# Altium schematic sheet DisplayPort.SchDoc
size A3; SheetNumber: 6; SheetTotal: 11
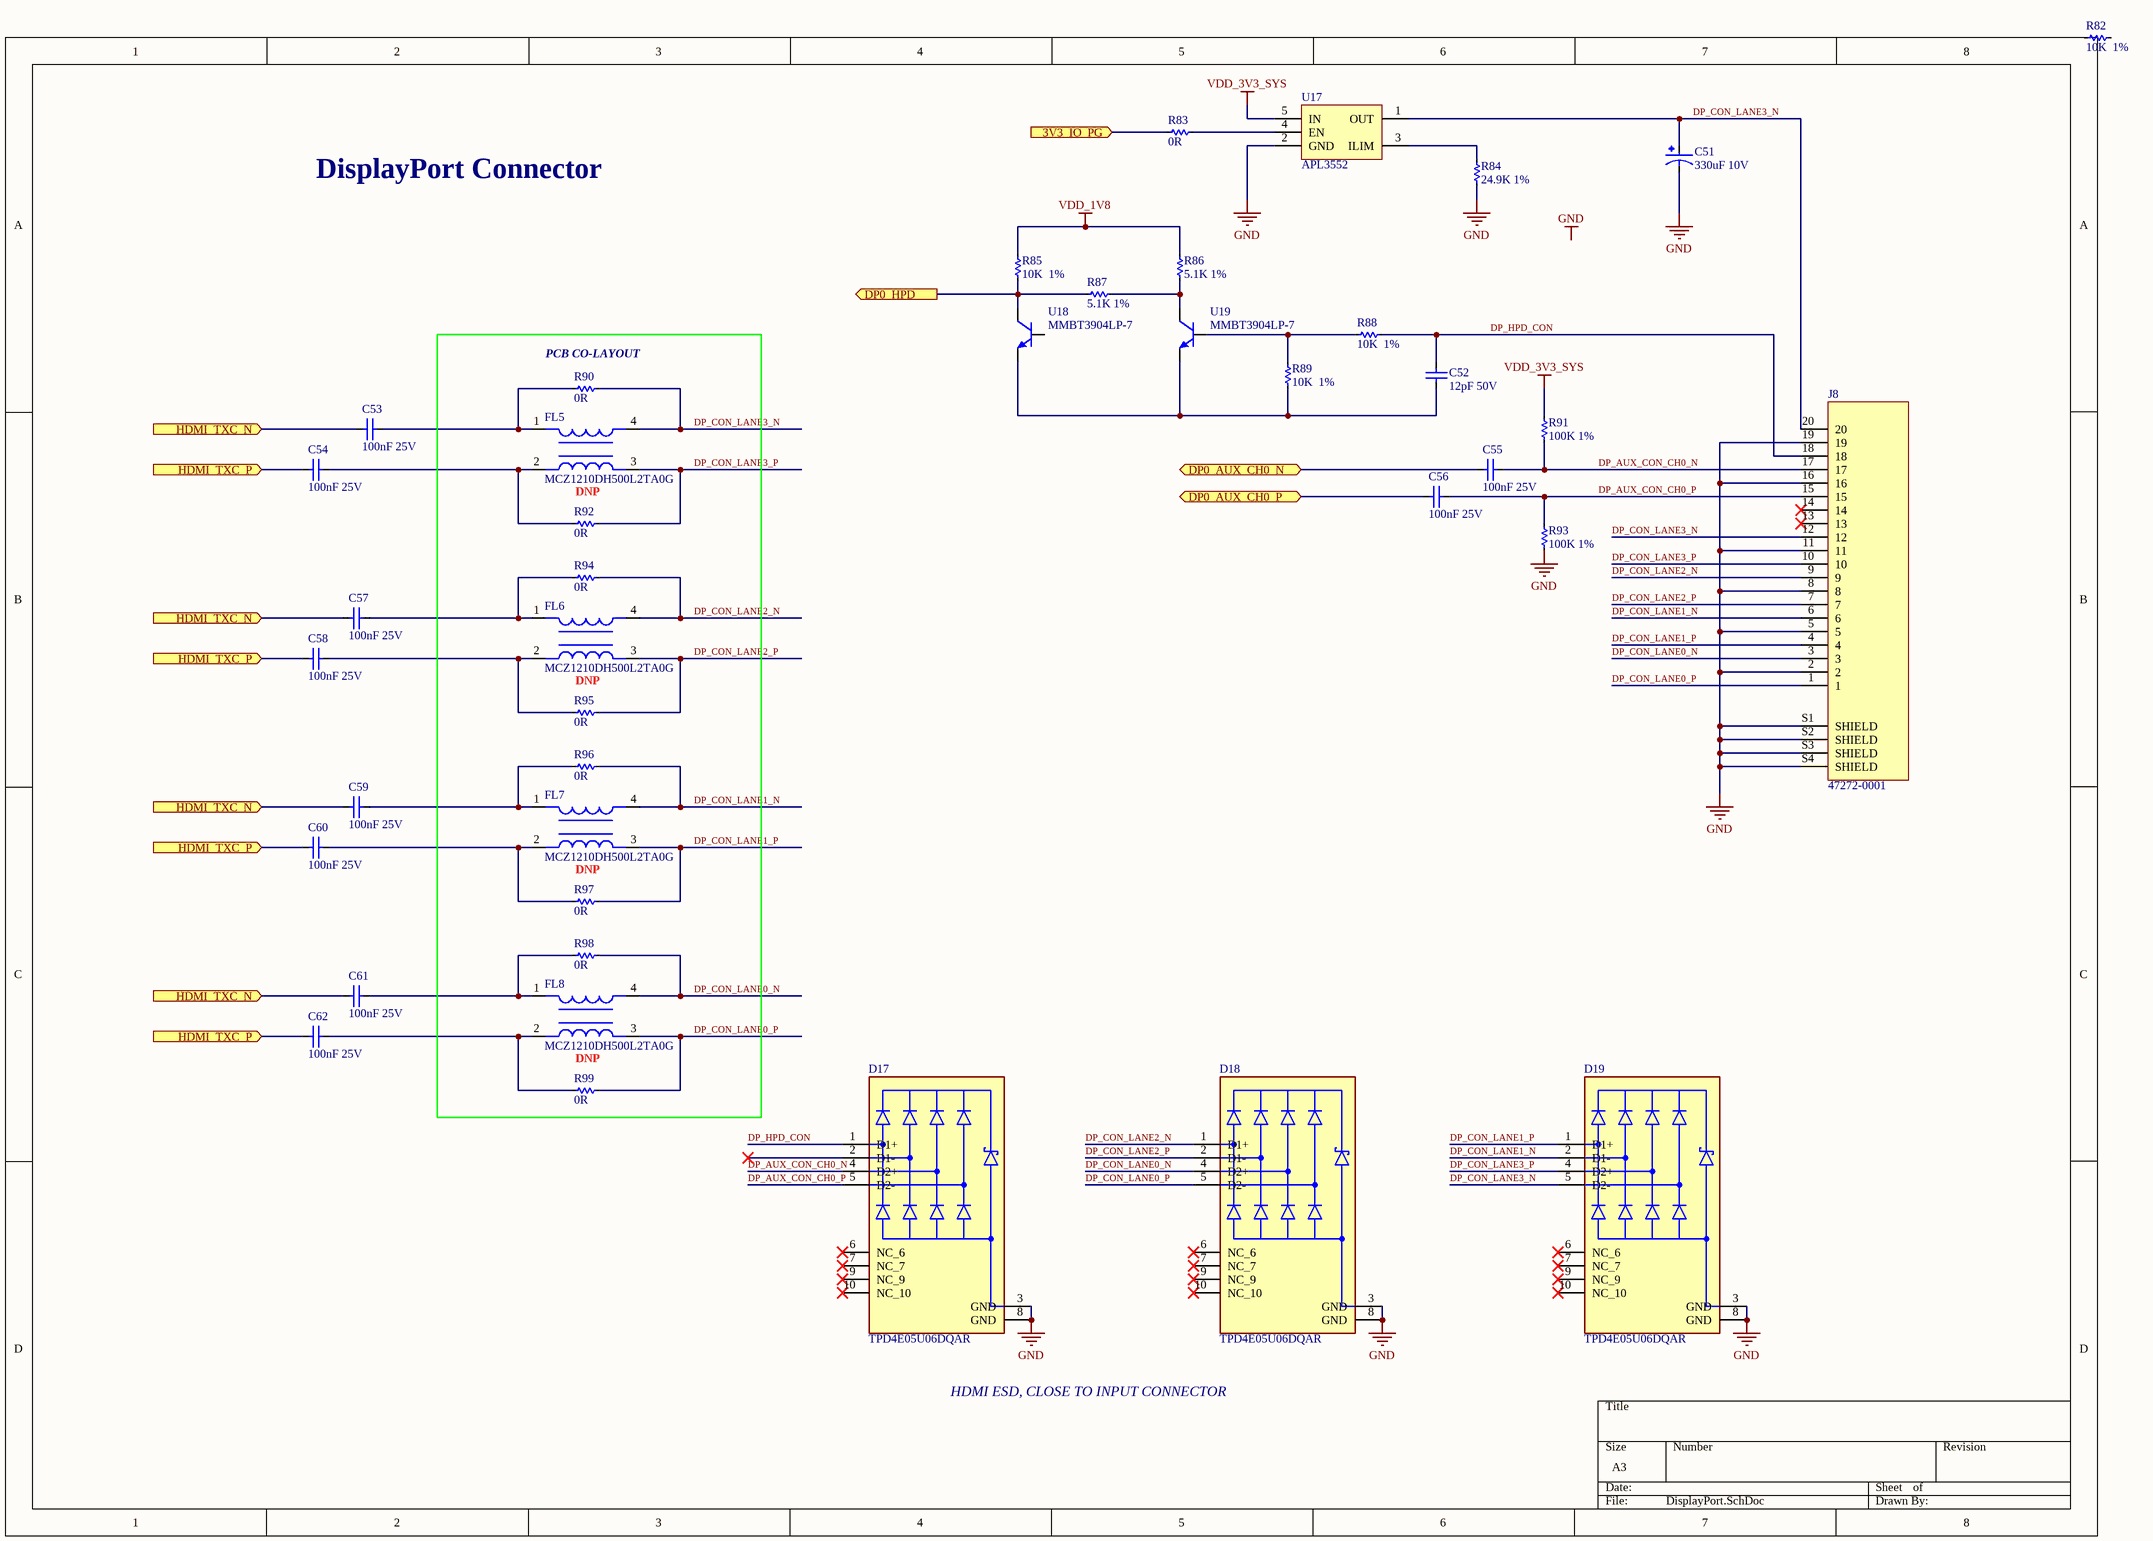
[diagram p0: DisplayPort.SchDoc]

## Parts
C51  330uF 10V  [C2917_Tantalum]
C52  12pF 50V  [C0402]
C53  100nF 25V  [C0402]
C54  100nF 25V  [C0402]
C55  100nF 25V  [C0402]
C56  100nF 25V  [C0402]
C57  100nF 25V  [C0402]
C58  100nF 25V  [C0402]
C59  100nF 25V  [C0402]
C60  100nF 25V  [C0402]
C61  100nF 25V  [C0402]
C62  100nF 25V  [C0402]
D17  TPD4E05U06DQAR  [TPD4E05U06DQAR]
D18  TPD4E05U06DQAR  [TPD4E05U06DQAR]
D19  TPD4E05U06DQAR  [TPD4E05U06DQAR]
FL5  MCZ1210DH500L2TA0G  [MCZ1210DH500L2TA0G]
FL6  MCZ1210DH500L2TA0G  [MCZ1210DH500L2TA0G]
FL7  MCZ1210DH500L2TA0G  [MCZ1210DH500L2TA0G]
FL8  MCZ1210DH500L2TA0G  [MCZ1210DH500L2TA0G]
J8  47272-0001  [47272-0001]
R82  10K  1%  [R0402]
R83  0R  [R0402]
R84  24.9K 1%  [R0402]
R85  10K  1%  [R0402]
R86  5.1K 1%  [R0402]
R87  5.1K 1%  [R0402]
R88  10K  1%  [R0402]
R89  10K  1%  [R0402]
R90  0R  [R0402]
R91  100K 1%  [R0402]
R92  0R  [R0402]
R93  100K 1%  [R0402]
R94  0R  [R0402]
R95  0R  [R0402]
R96  0R  [R0402]
R97  0R  [R0402]
R98  0R  [R0402]
R99  0R  [R0402]
U17  APL3552  [SOT23-5]
U18  MMBT3904LP-7  [DFN1006-3]
U19  MMBT3904LP-7  [DFN1006-3]

## Ports
3V3_IO_PG (in), DP0_AUX_CH0_N (bidir), DP0_AUX_CH0_P (bidir), DP0_HPD (out), HDMI_TXC_N (in), HDMI_TXC_P (in)

## Nets
GND: C51.2(C) D17.3(GND) D17.8(GND) D18.3(GND) D18.8(GND) D19.3(GND) D19.8(GND) J8.2 J8.5 J8.8 J8.11 J8.16 J8.19 J8.S1(SHIELD) J8.S2(SHIELD) J8.S3(SHIELD) J8.S4(SHIELD) R84.1 R93.1 U17.2(GND)
VDD_1V8: R85.2 R86.2
VDD_3V3_SYS: R91.2 U17.5(IN)
3V3_IO_PG: R83.1 ; port 3V3_IO_PG
DP0_AUX_CH0_N: C55.1 ; port DP0_AUX_CH0_N
DP0_AUX_CH0_P: C56.1 ; port DP0_AUX_CH0_P
DP0_HPD: R85.1 R87.1 U18.3(C) ; port DP0_HPD
DP_AUX_CON_CH0_N: C55.2 D17.4(D2+) J8.17 R91.1
DP_AUX_CON_CH0_P: C56.2 D17.5(D2-) J8.15 R93.2
DP_CON_LANE0_N: D18.4(D2+) FL8.4 J8.3 R98.2
DP_CON_LANE0_P: D18.5(D2-) FL8.3 J8.1 R99.2
DP_CON_LANE1_N: D19.2(D1-) FL7.4 J8.6 R96.2
DP_CON_LANE1_P: D19.1(D1+) FL7.3 J8.4 R97.2
DP_CON_LANE2_N: D18.1(D1+) FL6.4 J8.9 R94.2
DP_CON_LANE2_P: D18.2(D1-) FL6.3 J8.7 R95.2
DP_CON_LANE3_N: C51.1(A) D19.5(D2-) FL5.4 J8.12 J8.20 R90.2 U17.1(OUT)
DP_CON_LANE3_P: D19.4(D2+) FL5.3 J8.10 R92.2
DP_HPD_CON: C52.2 D17.1(D1+) J8.18 R88.2
HDMI_TXC_N: C53.1 C57.1 C59.1 C61.1 ; port HDMI_TXC_N
HDMI_TXC_P: C54.1 C58.1 C60.1 C62.1 ; port HDMI_TXC_P
NetC52_1: C52.1 R89.1 U18.2(E) U19.2(E)
NetC53_2: C53.2 FL5.1 R90.1
NetC54_2: C54.2 FL5.2 R92.1
NetC57_2: C57.2 FL6.1 R94.1
NetC58_2: C58.2 FL6.2 R95.1
NetC59_2: C59.2 FL7.1 R96.1
NetC60_2: C60.2 FL7.2 R97.1
NetC61_2: C61.2 FL8.1 R98.1
NetC62_2: C62.2 FL8.2 R99.1
NetR83_2: R83.2 U17.4(EN)
NetR84_2: R84.2 U17.3(ILIM)
NetR86_1: R86.1 R87.2 U19.3(C)
NetR88_1: R88.1 R89.2 U19.1(B)

Not connected (* = marked no-connect by the designer): D17 2(D1-)* 6(NC_6)* 7(NC_7)* 9(NC_9)* 10(NC_10)*; D18 6(NC_6)* 7(NC_7)* 9(NC_9)* 10(NC_10)*; D19 6(NC_6)* 7(NC_7)* 9(NC_9)* 10(NC_10)*; J8 13* 14*; R82 1 2; U18 1(B)

## Notes on the sheet
- DisplayPort Connector
- (near R90) PCB CO-LAYOUT
- DNP
- HDMI ESD, CLOSE TO INPUT CONNECTOR
- Labels drawn without touching a wire or pin: GND

## Library data of the parts
C51 = T55D337M010C0025: Cap Tant Polymer 330uF 10VDC D CASE 20% (7.3 X 4.3 X 2.8mm) SMD 7343-31 0.025 Ohm 105C T/R; Manufacturer: Vishay Sprague; Supplier 1: Mouser; Manufacturer Part Number: T55D337M010C0025; RoHS: Yes; Category: Tantalum Capacitors; Stock 1: 112760; Pricing 1: 1=1.79000, 10=1.23000, 50=1.23000, 100=1.07000, 1000=0.68200, 10000=0.52700 (USD); Lead Free: Lead Free; RoHS Compliant: Yes; Supplier Part Number 1: 74-T55D337M010C0025
C52 = CC0402JRNPO9BN120: 0402 12 pF 50 V ±5 % Tolerance NP0 SMT Multilayer Ceramic Capacitor; Manufacturer: Yageo; Tolerance: 5%; Dielectric: C0G; Supplier 1: Digi-Key; Manufacturer Part Number: CC0402JRNPO9BN120; RoHS: Yes; Category: Ceramic Capacitors; Stock 1: 3125525; Pricing 1: 1=0.10000, 10=0.01800, 50=0.01000, 100=0.00820, 500=0.00584, 1000=0.00458, 2500=0.00417, 5000=0.00383 (USD); Mount: Surface Mount; Case/Package: 0402; Number of Pins: 2; Case Code (Metric): 1005; Case Code (Imperial): 0402; Min Operating Temperature: -55°C; Max Operating Temperature: 125°C; Package Quantity: 1; Capacitance: 12pF; Voltage Rating: 50V; Packaging: Tape and Reel; Voltage Rating (DC): 50V; Termination: SMD/SMT; Resistor Type: Ceramic; Series: CC; Length: 1mm; Width: 0.02inch; Height: 0.5mm; Thickness: 0.022inch; Depth: 0.5mm; Radiation Hardening: No; Reach SVHC Compliant: Yes; Lead Free: Lead Free; RoHS Compliant: Yes; ComponentLink1URL: https://datasheet.ciiva.com/28450/1443161-28450222.pdf?src-supplier=Element14; ComponentLink1Description: https://datasheet.ciiva.com/28450/1443161-28450222.pdf?src-supplier=Element14; ComponentLink2URL: https://datasheet.ciiva.com/161/mlccorderingcode-161487.pdf?src-supplier=Digi-Key; ComponentLink2Description: https://datasheet.ciiva.com/161/mlccorderingcode-161487.pdf?src-supplier=Digi-Key; ComponentLink3URL: https://datasheet.ciiva.com/161/mlccorderingcode-161486.pdf?src-supplier=Digi-Key; ComponentLink3Description: https://datasheet.ciiva.com/161/mlccorderingcode-161486.pdf?src-supplier=Digi-Key; ComponentLink4URL: https://datasheet.ciiva.com/161/mlccorderingcode-161488.pdf?src-supplier=Digi-Key; ComponentLink4Description: https://datasheet.ciiva.com/161/mlccorderingcode-161488.pdf?src-supplier=Digi-Key; ComponentLink5URL: https://datasheet.ciiva.com/5425/upy-gp-np0-16v-to-50v-8-5425431.pdf?src-supplier=Mouser; ComponentLink5Description: https://datasheet.ciiva.com/5425/upy-gp-np0-16v-to-50v-8-5425431.pdf?src-supplier=Mouser; ComponentLink6URL: https://datasheet.ciiva.com/11587/upy-gp-np0-16v-to-50v-8-11587083.pdf?src-supplier=Avnet; ComponentLink6Description: https://datasheet.ciiva.com/11587/upy-gp-np0-16v-to-50v-8-11587083.pdf?src-supplier=Avnet; Supplier Part Number 1: 311-1016-1-ND
C53-C62 = 04023C104KAT2A: 0402 100 nF 25 V ±10 % Tolerance X7R Surface Mount Multilayer Ceramic Capacitor; Manufacturer: Kyocera AVX; Tolerance: 10%; Supplier 1: Digi-Key; Manufacturer Part Number: 04023C104KAT2A; RoHS: Yes; Category: Ceramic Capacitors; Stock 1: 3248475; Pricing 1: 1=0.10000, 10=0.03300, 50=0.01820, 100=0.01480, 500=0.01060, 1000=0.00833, 2500=0.00758, 5000=0.00697 (USD); Mount: Surface Mount; Case/Package: 0402; Number of Pins: 2; Case Code (Metric): 1005; Case Code (Imperial): 0402; Min Operating Temperature: -55°C; Max Operating Temperature: 125°C; Capacitance: 100nF; Packaging: Cut Tape; Dielectric: X7R; Voltage Rating (DC): 25V; Voltage Rating: 25V; Package Quantity: 1; Termination: SMD/SMT; Voltage: 25V; Series: -; Construction: Flat; Length: 1mm; Width: 1mm; Thickness: 0.022inch; Depth: 0.5mm; Radiation Hardening: No; Reach SVHC Compliant: Yes; Lead Free: Lead Free; RoHS Compliant: Yes; ComponentLink1URL: https://datasheet.ciiva.com/1123/1679506-1123344.pdf?src-supplier=Element14; ComponentLink1Description: https://datasheet.ciiva.com/1123/1679506-1123344.pdf?src-supplier=Element14; ComponentLink2URL: https://datasheet.ciiva.com/7614/cx7r-7614663.pdf?src-supplier=Digi-Key; ComponentLink2Description: https://datasheet.ciiva.com/7614/cx7r-7614663.pdf?src-supplier=Digi-Key; ComponentLink3URL: https://datasheet.ciiva.com/7709/1679506-7709527.pdf?src-supplier=Element14; ComponentLink3Description: https://datasheet.ciiva.com/7709/1679506-7709527.pdf?src-supplier=Element14; ComponentLink4URL: https://datasheet.ciiva.com/6265/cx7r-6265272.pdf?src-supplier=Digi-Key; ComponentLink4Description: https://datasheet.ciiva.com/6265/cx7r-6265272.pdf?src-supplier=Digi-Key; ComponentLink5URL: https://datasheet.ciiva.com/14906/cx7r-14906223.pdf?src-supplier=Digi-Key; ComponentLink5Description: https://datasheet.ciiva.com/14906/cx7r-14906223.pdf?src-supplier=Digi-Key; Supplier Part Number 1: 478-7868-1-ND
D17-D19 = TPD4E05U06DQAR: Quad 0.5-pF, 5.5-V, ±12-kV ESD protection diode for USB, HDMI & High Speed Interfaces; Manufacturer: Texas Instruments; Direction: Unidirectional; Capacitance: 0.5pF; Number of Bidirectional Channels: 4; Reverse Standoff Voltage: 5.5V; Min Breakdown Voltage: 6V; Clamping Voltage: 14V; Peak Pulse Power: 40W; Power Line Protection: Yes; Leakage Current: 10nA; Peak Pulse Current: 2.5A; Interface: LVDS,USB,Ethernet,HDMI,PCIe,SATA; Supplier 1: Mouser; Manufacturer Part Number: TPD4E05U06DQAR; RoHS: Yes; Category: Integrated Circuits (ICs); Stock 1: 71744; Pricing 1: 1=0.66000, 10=0.58100, 50=0.54600, 100=0.44600, 1000=0.28200, 10000=0.25500 (USD); Mount: Surface Mount; Case/Package: SON; Number of Pins: 10; Contact Plating: Gold; Min Operating Temperature: -40°C; Max Operating Temperature: 125°C; Packaging: Tape and Reel; Package Quantity: 3000; Polarity: Unidirectional; Number of Channels: 4; Breakdown Voltage: 6V; Max Power Dissipation: 40W; Termination: SMD/SMT; Working Voltage: 5.5V; Operating Supply Voltage: 5.5V; Series: -; Number of Unidirectional Channels: 4; Length: 2.6mm; Depth: 1.1mm; Radiation Hardening: No; Reach SVHC Compliant: Yes; Lead Free: Lead Free; RoHS Compliant: Yes; ComponentLink1URL: https://datasheet.ciiva.com/15063/tpd4e05u06-15063653.pdf?src-supplier=Digi-Key; ComponentLink1Description: https://datasheet.ciiva.com/15063/tpd4e05u06-15063653.pdf?src-supplier=Digi-Key; ComponentLink2URL: https://datasheet.ciiva.com/24119/slvsbo7f-316827-24119436.pdf?src-supplier=Mouser; ComponentLink2Description: https://datasheet.ciiva.com/24119/slvsbo7f-316827-24119436.pdf?src-supplier=Mouser; ComponentLink3URL: https://datasheet.ciiva.com/26918/getdatasheetpartid-716763-26918024.pdf?src-supplier=Verical; ComponentLink3Description: https://datasheet.ciiva.com/26918/getdatasheetpartid-716763-26918024.pdf?src-supplier=Verical; ComponentLink4URL: https://datasheet.ciiva.com/15063/tpd4e05u06-15063654.pdf?src-supplier=Digi-Key; ComponentLink4Description: https://datasheet.ciiva.com/15063/tpd4e05u06-15063654.pdf?src-supplier=Digi-Key; ComponentLink5URL: https://datasheet.ciiva.com/15063/tpd4e05u06-15063655.pdf?src-supplier=Digi-Key; ComponentLink5Description: https://datasheet.ciiva.com/15063/tpd4e05u06-15063655.pdf?src-supplier=Digi-Key; ComponentLink6URL: https://datasheet.ciiva.com/29883/tpd4e05u06-29883798.pdf?src-supplier=Avnet; ComponentLink6Description: https://datasheet.ciiva.com/29883/tpd4e05u06-29883798.pdf?src-supplier=Avnet; Supplier Part Number 1: 595-TPD4E05U06DQAR
FL5-FL8 = MCZ1210DH500L2TA0G: 2 Line Common Mode Choke Surface Mount 50 Ohms 100mA DCR 2.5Ohm; Manufacturer: TDK; Number of Lines: 2; DC Resistance (DCR): 2.5R; Voltage Rating (DC): 5V; Supplier 1: Mouser; Manufacturer Part Number: MCZ1210DH500L2TA0G; RoHS: Yes; Category: Common Mode Chokes; Stock 1: 8170; Pricing 1: 1=0.64000, 10=0.62200, 50=0.62200, 100=0.49900, 1000=0.33900, 10000=0.24500 (USD); Mount: Surface Mount; Case Code (Metric): 3225; Case Code (Imperial): 1210; Min Operating Temperature: -40°C; Max Operating Temperature: 85°C; Packaging: Tape and Reel; Max Current Rating: 100mA; Length: 0.049inch; Width: 0.039inch; Height: 0.024inch; RoHS Compliant: Yes; ComponentLink1URL: https://product.tdk.com/info/en/catalog/datasheets/cmf_commercial_signal_mcz1210dh_en.pdf?ref_disty=digikey&src-supplier=Digi-Key; ComponentLink1Description: https://product.tdk.com/info/en/catalog/datasheets/cmf_commercial_signal_mcz1210dh_en.pdf?ref_disty=digikey&src-supplier=Digi-Key; Supplier Part Number 1: 810-MCZ1210DH500L2TG
J8 = 47272-0001: Conn Display Port RCP 20 POS 0.5mm Solder RA SMD 20 Terminal 1 Port DisplayPort Embossed T/R; Manufacturer: Molex; Body Material: Metal,Stainless Steel; Number of Terminals/Pins: 20; Contact Resistance: 30mR; Mating Cycles: 10000; Voltage Rating (AC): 40V; Gender: Receptacle; Current Rating: 500mA; Number of Ports: 1; Insulation Resistance: 10MR; Shielding: Shielded; Supplier 1: Digi-Key; Manufacturer Part Number: 47272-0001; RoHS: Yes; Category: Audio / Video Connectors; Stock 1: 12949; Pricing 1: 1=6.19000, 10=5.45100, 100=4.33640 (USD); Mount: Surface Mount,Horizontal,Through Hole; Number of Pins: 20; Contact Plating: Gold; Contact Material: Copper Alloy; Color: Black; Housing Material: Thermoplastic; Weight: 0.09591oz; Insulation Color: Black; Min Operating Temperature: -20°C; Max Operating Temperature: 85°C; Number of Rows: 2; Max Voltage Rating (AC): 40V; Packaging: Tape and Reel; Package Quantity: 1; Number of Positions: 20; Termination: Solder; Number of Contacts: 20; Voltage Rating: 40V; Max Current Rating: 500mA; Orientation: Right Angle; Number of Circuits: 20; Features: Shielded; Series: 47272; Length: 17.79mm; Lead Pitch: 0.5mm; Pitch: 0.5mm; Depth: 14.39mm; Radiation Hardening: No; Halogen Free: Low Halogen; Flammability Rating: UL94 V-0; RoHS Compliant: Yes; Supplier Part Number 1: WM19271CT-ND; ComponentLink1Description: Datasheet; ComponentLink1URL: https://datasheet.ciiva.com/1097/1712025-1097373.pdf?src-supplier=Farnell
R82 R85 R88 R89 = RC0402FR-0710KP: Res General Purpose Thick Film 0402 10K Ohm 1% 1/16W ±100ppm/°C Molded SMD Paper T/R; Manufacturer: Yageo; Resistance: 10kR; Max Power Dissipation: 63mW; Temperature Coefficient: 150ppm/°C; Supplier 1: Digi-Key; Manufacturer Part Number: RC0402FR-0710KP; RoHS: Yes; Category: Chip SMD Resistors; Stock 1: 1032587; Pricing 1: 1=0.10000, 10=0.03100, 100=0.01280, 1000=0.00573, 2500=0.00497, 5000=0.00411 (USD); Case/Package: 0402; Case Code (Metric): 1005; Case Code (Imperial): 0402; Min Operating Temperature: -55°C; Max Operating Temperature: 155°C; Packaging: Tape and Reel; Resistor Type: Thick Film; Number of Terminations: 2; Tolerance: 1%; Features: Moisture Resistant; Length: 0.039inch; Width: 0.02inch; Height: 0.016inch; RoHS Compliant: Yes; ComponentLink1URL: http://www.yageo.com/NewPortal/yageodocoutput?fileName=/pdf/R-Chip/PYu-RC_51_RoHS_P_0.pdf&src-supplier=Digi-Key; ComponentLink1Description: http://www.yageo.com/NewPortal/yageodocoutput?fileName=/pdf/R-Chip/PYu-RC_51_RoHS_P_0.pdf&src-supplier=Digi-Key; Supplier Part Number 1: YAG1249CT-ND
R83 = RC0402FR-070RL: RC Series 0402 0.063 W 0 Ohm Jumper Surface Mount Thick Film Chip Resistor; Manufacturer: Yageo; Tolerance: 1%; Power Rating: 62.5mW; Voltage Rating: 50V; Temperature Coefficient: 200ppm/°C; Max Power Dissipation: 63mW; Supplier 1: Digi-Key; Manufacturer Part Number: RC0402FR-070RL; RoHS: Yes; Category: Chip SMD Resistors; Stock 1: 8989202; Pricing 1: 1=0.10000, 10=0.01200, 25=0.00840, 50=0.00640, 100=0.00480, 250=0.00364, 500=0.00290, 1000=0.00214, 5000=0.00154 (USD); Mount: Surface Mount; Case/Package: 0402; Case Code (Imperial): 0402; Case Code (Metric): 1005; Contact Plating: Tin,Matte; Size Code: 0402; Min Operating Temperature: -55°C; Max Operating Temperature: 155°C; Resistance: 0R; Packaging: Tape and Reel; Resistor Type: Thick Film; Termination: SMD/SMT; Features: Moisture Resistant; Series: RC; Number of Terminations: 2; Length: 1mm; Width: 0.5mm; Height: 0.35mm; Radiation Hardening: No; Lead Free: Lead Free; RoHS Compliant: Yes; ComponentLink1URL: https://datasheet.ciiva.com/8896/pyu-rc0402-51-rohs-l-6-8896149.pdf?src-supplier=Avnet; ComponentLink1Description: https://datasheet.ciiva.com/8896/pyu-rc0402-51-rohs-l-6-8896149.pdf?src-supplier=Avnet; ComponentLink2URL: https://datasheet.ciiva.com/16790/pyu-rc0402-51-rohs-l-6-r-16790444.pdf?src-supplier=Future+Electronics; ComponentLink2Description: https://datasheet.ciiva.com/16790/pyu-rc0402-51-rohs-l-6-r-16790444.pdf?src-supplier=Future+Electronics; Supplier Part Number 1: 311-0.0LRCT-ND
R84 = RC0402FR-0724K9L: Res Thick Film 0402 24.9K Ohm 1% 1/16W ±100ppm/°C Molded SMD Paper T/R; Manufacturer: Yageo; Resistance: 24.9kR; Power Rating: 62.5mW; Voltage Rating: 50V; Max Power Dissipation: 63mW; Supplier 1: Mouser; Manufacturer Part Number: RC0402FR-0724K9L; RoHS: Yes; Category: Chip SMD Resistors; Stock 1: 1202856; Pricing 1: 1=0.10000, 10=0.01600, 50=0.01600, 100=0.00700, 1000=0.00300, 10000=0.00100 (USD); Case/Package: 0402; Case Code (Metric): 1005; Case Code (Imperial): 0402; Contact Plating: Tin,Matte; Size Code: 0402; Min Operating Temperature: -55°C; Max Operating Temperature: 155°C; Tolerance: 1%; Package Quantity: 1; Packaging: Tape and Reel; Resistor Type: Thick Film; Number of Terminations: 2; Termination: SMD/SMT; Temperature Coefficient: 100ppm/°C; Voltage Rating (DC): 50V; Features: Moisture Resistant; Series: RC; Construction: Rectangular; Length: 1mm; Width: 0.02inch; Height: 0.016inch; Depth: 0.5mm; Military Standard: Not; Lead Free: Lead Free; RoHS Compliant: Yes; ComponentLink1URL: https://datasheet.ciiva.com/2519/pyu-r-int-thick-7-2519127.pdf?src-supplier=Digi-Key; ComponentLink1Description: https://datasheet.ciiva.com/2519/pyu-r-int-thick-7-2519127.pdf?src-supplier=Digi-Key; ComponentLink2URL: https://datasheet.ciiva.com/2519/pyu-r-int-thick-7-2519128.pdf?src-supplier=Digi-Key; ComponentLink2Description: https://datasheet.ciiva.com/2519/pyu-r-int-thick-7-2519128.pdf?src-supplier=Digi-Key; ComponentLink3URL: https://datasheet.ciiva.com/2519/pyu-r-int-thick-7-2519126.pdf?src-supplier=Digi-Key; ComponentLink3Description: https://datasheet.ciiva.com/2519/pyu-r-int-thick-7-2519126.pdf?src-supplier=Digi-Key; ComponentLink4URL: https://datasheet.ciiva.com/12667/pyu-rc0402-51-rohs-l-6-r-12667961.pdf?src-supplier=Mouser; ComponentLink4Description: https://datasheet.ciiva.com/12667/pyu-rc0402-51-rohs-l-6-r-12667961.pdf?src-supplier=Mouser; ComponentLink5URL: https://datasheet.ciiva.com/8889/pyu-rc0402-51-rohs-l-6-8889995.pdf?src-supplier=Avnet; ComponentLink5Description: https://datasheet.ciiva.com/8889/pyu-rc0402-51-rohs-l-6-8889995.pdf?src-supplier=Avnet; ComponentLink6URL: https://datasheet.ciiva.com/17019/pyu-rc0402-51-rohs-l-6-r-17019690.pdf?src-supplier=Future+Electronics; ComponentLink6Description: https://datasheet.ciiva.com/17019/pyu-rc0402-51-rohs-l-6-r-17019690.pdf?src-supplier=Future+Electronics; Supplier Part Number 1: 603-RC0402FR-0724K9L
R86 R87 = RC0402FR-075K1L: Res Thick Film 1.0 x 0.5 mm 5.1K Ohm 1% 0.063W(1/16W) 100ppm/ C Molded SMD Paper T/R; Manufacturer: Yageo; Power Rating: 63mW; Voltage Rating: 50V; Resistance: 5.1kR; Temperature Coefficient: 100ppm/°C; Supplier 1: Digi-Key; Manufacturer Part Number: RC0402FR-075K1L; RoHS: Yes; Category: Chip SMD Resistors; Stock 1: 2429818; Pricing 1: 1=0.10000, 10=0.01400, 100=0.00580, 1000=0.00262, 2500=0.00228, 5000=0.00188 (USD); Case/Package: 0402; Case Code (Metric): 1005; Case Code (Imperial): 0402; Min Operating Temperature: -55°C; Max Operating Temperature: 155°C; Tolerance: 1%; Packaging: Tape and Reel; Package Quantity: 1; Resistor Type: Thick Film; Number of Terminations: 2; Termination: SMD/SMT; Max Power Dissipation: 63mW; Voltage Rating (DC): 50V; Features: Moisture Resistant; Series: RC; Resistance Tolerance: 1%; Construction: Rectangular; Technology: THICK FILM; Working Voltage: 50V; Length: 1mm; Width: 0.02inch; Height: 0.016inch; Depth: 0.5mm; Military Standard: Not; Lead Free: Lead Free; RoHS Compliant: Yes; ComponentLink1URL: https://datasheet.ciiva.com/7983/1018594-7983519.pdf?src-supplier=Element14; ComponentLink1Description: https://datasheet.ciiva.com/7983/1018594-7983519.pdf?src-supplier=Element14; ComponentLink2URL: https://datasheet.ciiva.com/46394/1018594-46394936.pdf?src-supplier=Element14; ComponentLink2Description: https://datasheet.ciiva.com/46394/1018594-46394936.pdf?src-supplier=Element14; ComponentLink3URL: https://datasheet.ciiva.com/2453/pyu-r-int-thick-7-2453401.pdf?src-supplier=Digi-Key; ComponentLink3Description: https://datasheet.ciiva.com/2453/pyu-r-int-thick-7-2453401.pdf?src-supplier=Digi-Key; ComponentLink4URL: https://datasheet.ciiva.com/2453/pyu-r-int-thick-7-2453402.pdf?src-supplier=Digi-Key; ComponentLink4Description: https://datasheet.ciiva.com/2453/pyu-r-int-thick-7-2453402.pdf?src-supplier=Digi-Key; ComponentLink5URL: https://datasheet.ciiva.com/2453/pyu-r-int-thick-7-2453400.pdf?src-supplier=Digi-Key; ComponentLink5Description: https://datasheet.ciiva.com/2453/pyu-r-int-thick-7-2453400.pdf?src-supplier=Digi-Key; ComponentLink6URL: https://datasheet.ciiva.com/12558/pyu-rc0402-51-rohs-l-6-r-8721-12558460.pdf?src-supplier=Mouser; ComponentLink6Description: https://datasheet.ciiva.com/12558/pyu-rc0402-51-rohs-l-6-r-8721-12558460.pdf?src-supplier=Mouser; ComponentLink7URL: https://datasheet.ciiva.com/16744/pyu-rc0402-51-rohs-l-6-r-16744283.pdf?src-supplier=Future+Electronics; ComponentLink7Description: https://datasheet.ciiva.com/16744/pyu-rc0402-51-rohs-l-6-r-16744283.pdf?src-supplier=Future+Electronics; ComponentLink8URL: https://datasheet.ciiva.com/15189/getdatasheetpartid-323636-15189493.pdf?src-supplier=Verical; ComponentLink8Description: https://datasheet.ciiva.com/15189/getdatasheetpartid-323636-15189493.pdf?src-supplier=Verical; Supplier Part Number 1: 311-5.10KLRCT-ND
R90 R92 R94-R99 = RC0402JR-070RP: Res Jumper Thick Film 0402 0 Ohm 5% 1/16W Molded SMD Paper T/R; Manufacturer: Yageo; Resistance: 0mR; Max Power Dissipation: 63mW; Supplier 1: Digi-Key; Manufacturer Part Number: RC0402JR-070RP; RoHS: Yes; Category: Chip SMD Resistors; Stock 1: 5886851; Pricing 1: 1=0.10000, 10=0.02300, 25=0.01640, 50=0.01240, 100=0.00920, 250=0.00700, 500=0.00560, 1000=0.00412, 5000=0.00296 (USD); Case/Package: 0402; Case Code (Metric): 1005; Case Code (Imperial): 0402; Min Operating Temperature: -55°C; Max Operating Temperature: 155°C; Packaging: Tape and Reel; Resistor Type: Thick Film; Number of Terminations: 2; Features: Moisture Resistant; Length: 0.039inch; Width: 0.02inch; Height: 0.016inch; RoHS Compliant: Yes; ComponentLink1URL: http://www.yageo.com/NewPortal/yageodocoutput?fileName=/pdf/R-Chip/PYu-RC_51_RoHS_P_0.pdf&src-supplier=Digi-Key; ComponentLink1Description: http://www.yageo.com/NewPortal/yageodocoutput?fileName=/pdf/R-Chip/PYu-RC_51_RoHS_P_0.pdf&src-supplier=Digi-Key; Supplier Part Number 1: YAG1279CT-ND
R91 R93 = RC0402FR-07100KL: RES SMD 100K OHM 1% 1/16W 0402; Manufacturer: Yageo; Power Rating: 63mW; Voltage Rating: 50V; Resistance: 100kR; Temperature Coefficient: 100ppm/°C; Supplier 1: Digi-Key; Manufacturer Part Number: RC0402FR-07100KL; RoHS: Yes; Category: Chip SMD Resistors; Stock 1: 41082272; Pricing 1: 1=0.10000, 10=0.01400, 100=0.00580, 1000=0.00262, 2500=0.00228, 5000=0.00188 (USD); Case/Package: 0402; Case Code (Metric): 1005; Case Code (Imperial): 0402; Min Operating Temperature: -55°C; Max Operating Temperature: 155°C; Tolerance: 1%; Package Quantity: 1; Packaging: Tape and Reel; Resistor Type: Thick Film; Number of Terminations: 2; Termination: SMD/SMT; Max Power Dissipation: 63mW; Working Voltage: 50V; Features: Moisture Resistant; Series: RC; Resistance Tolerance: 1%; Construction: Rectangular; Technology: THICK FILM; Length: 0.039inch; Width: 0.02inch; Height: 0.016inch; Depth: 0.5mm; Reach SVHC Compliant: Yes; Military Standard: Not; Lead Free: Lead Free; RoHS Compliant: Yes; ComponentLink1URL: https://datasheet.ciiva.com/11819/0900766b80c66297-11819452.pdf?src-supplier=RSComponents; ComponentLink1Description: https://datasheet.ciiva.com/11819/0900766b80c66297-11819452.pdf?src-supplier=RSComponents; ComponentLink2URL: https://datasheet.ciiva.com/22747/1018594-22747509.pdf?src-supplier=Element14; ComponentLink2Description: https://datasheet.ciiva.com/22747/1018594-22747509.pdf?src-supplier=Element14; ComponentLink3URL: https://datasheet.ciiva.com/2453/pyu-r-int-thick-7-2453362.pdf?src-supplier=Digi-Key; ComponentLink3Description: https://datasheet.ciiva.com/2453/pyu-r-int-thick-7-2453362.pdf?src-supplier=Digi-Key; ComponentLink4URL: https://datasheet.ciiva.com/2453/pyu-r-int-thick-7-2453363.pdf?src-supplier=Digi-Key; ComponentLink4Description: https://datasheet.ciiva.com/2453/pyu-r-int-thick-7-2453363.pdf?src-supplier=Digi-Key; ComponentLink5URL: https://datasheet.ciiva.com/2453/pyu-r-int-thick-7-2453361.pdf?src-supplier=Digi-Key; ComponentLink5Description: https://datasheet.ciiva.com/2453/pyu-r-int-thick-7-2453361.pdf?src-supplier=Digi-Key; ComponentLink6URL: https://datasheet.ciiva.com/12667/pyu-rc0402-51-rohs-l-6-r-12667930.pdf?src-supplier=Mouser; ComponentLink6Description: https://datasheet.ciiva.com/12667/pyu-rc0402-51-rohs-l-6-r-12667930.pdf?src-supplier=Mouser; ComponentLink7URL: https://datasheet.ciiva.com/15189/getdatasheetpartid-323696-15189334.pdf?src-supplier=Verical; ComponentLink7Description: https://datasheet.ciiva.com/15189/getdatasheetpartid-323696-15189334.pdf?src-supplier=Verical; Supplier Part Number 1: 311-100KLRCT-ND
U17 = APL3552: The APL3552 series of power switches integrate a 62mW N-channel MOSFET.; ComponentLink1Description: Datasheet; ComponentLink1URL: https://datasheet.lcsc.com/lcsc/2004172033_Anpec-Elec-APL3552ACI-TRG_C503680.pdf
U18 U19 = MMBT3904LP-7: TRANS NPN 40V 0.2A DFN1006-3; Manufacturer: Diodes; Max Power Dissipation: 250mW; Max Collector Current: 200mA; Transition Frequency: 300MHz; Collector Base Voltage (VCBO): 60V; Element Configuration: Single; Emitter Base Voltage (VEBO): 6V; Collector Emitter Saturation Voltage: 300mV; Supplier 1: Mouser; Manufacturer Part Number: MMBT3904LP-7; RoHS: Yes; Category: BJTs; Stock 1: 4838; Pricing 1: 1=0.41000, 10=0.30600, 50=0.30600, 100=0.19100, 1000=0.10100, 10000=0.07700 (USD); Mount: Surface Mount; Case/Package: DFN; Number of Pins: 3; Weight: 0.000282oz; Min Operating Temperature: -55°C; Max Operating Temperature: 150°C; Package Quantity: 3000; Packaging: Tape and Reel; Collector Emitter Voltage (VCEO): 40V; Collector Emitter Breakdown Voltage: 40V; Polarity: NPN; Gain Bandwidth Product: 300MHz; Continuous Collector Current: 200mA; Collector-emitter Voltage-Max: 300mV; Series: Automotive, AEC-Q101; Max Breakdown Voltage: 40V; Length: 1mm; Width: 0.6mm; Height: 0.5mm; Radiation Hardening: No; Lead Free: Lead Free; Reach SVHC Compliant: Yes; RoHS Compliant: Yes; ComponentLink1URL: https://datasheet.ciiva.com/12330/ds30036-41708-12330497.pdf?src-supplier=Mouser; ComponentLink1Description: https://datasheet.ciiva.com/12330/ds30036-41708-12330497.pdf?src-supplier=Mouser; ComponentLink2URL: https://datasheet.ciiva.com/11199/ds31835-11199001.pdf?src-supplier=Avnet; ComponentLink2Description: https://datasheet.ciiva.com/11199/ds31835-11199001.pdf?src-supplier=Avnet; ComponentLink3URL: https://datasheet.ciiva.com/11206/ds31835-11206492.pdf?src-supplier=Avnet; ComponentLink3Description: https://datasheet.ciiva.com/11206/ds31835-11206492.pdf?src-supplier=Avnet; ComponentLink4URL: https://datasheet.ciiva.com/16463/ds31835-16463047.pdf?src-supplier=Future+Electronics; ComponentLink4Description: https://datasheet.ciiva.com/16463/ds31835-16463047.pdf?src-supplier=Future+Electronics; ComponentLink5URL: https://datasheet.ciiva.com/18648/ds31835-18648085.pdf?src-supplier=Digi-Key; ComponentLink5Description: https://datasheet.ciiva.com/18648/ds31835-18648085.pdf?src-supplier=Digi-Key; Supplier Part Number 1: 621-MMBT3904LP-7